# EAGLE schematic DragonBoard (EAGLE 6.6.0)
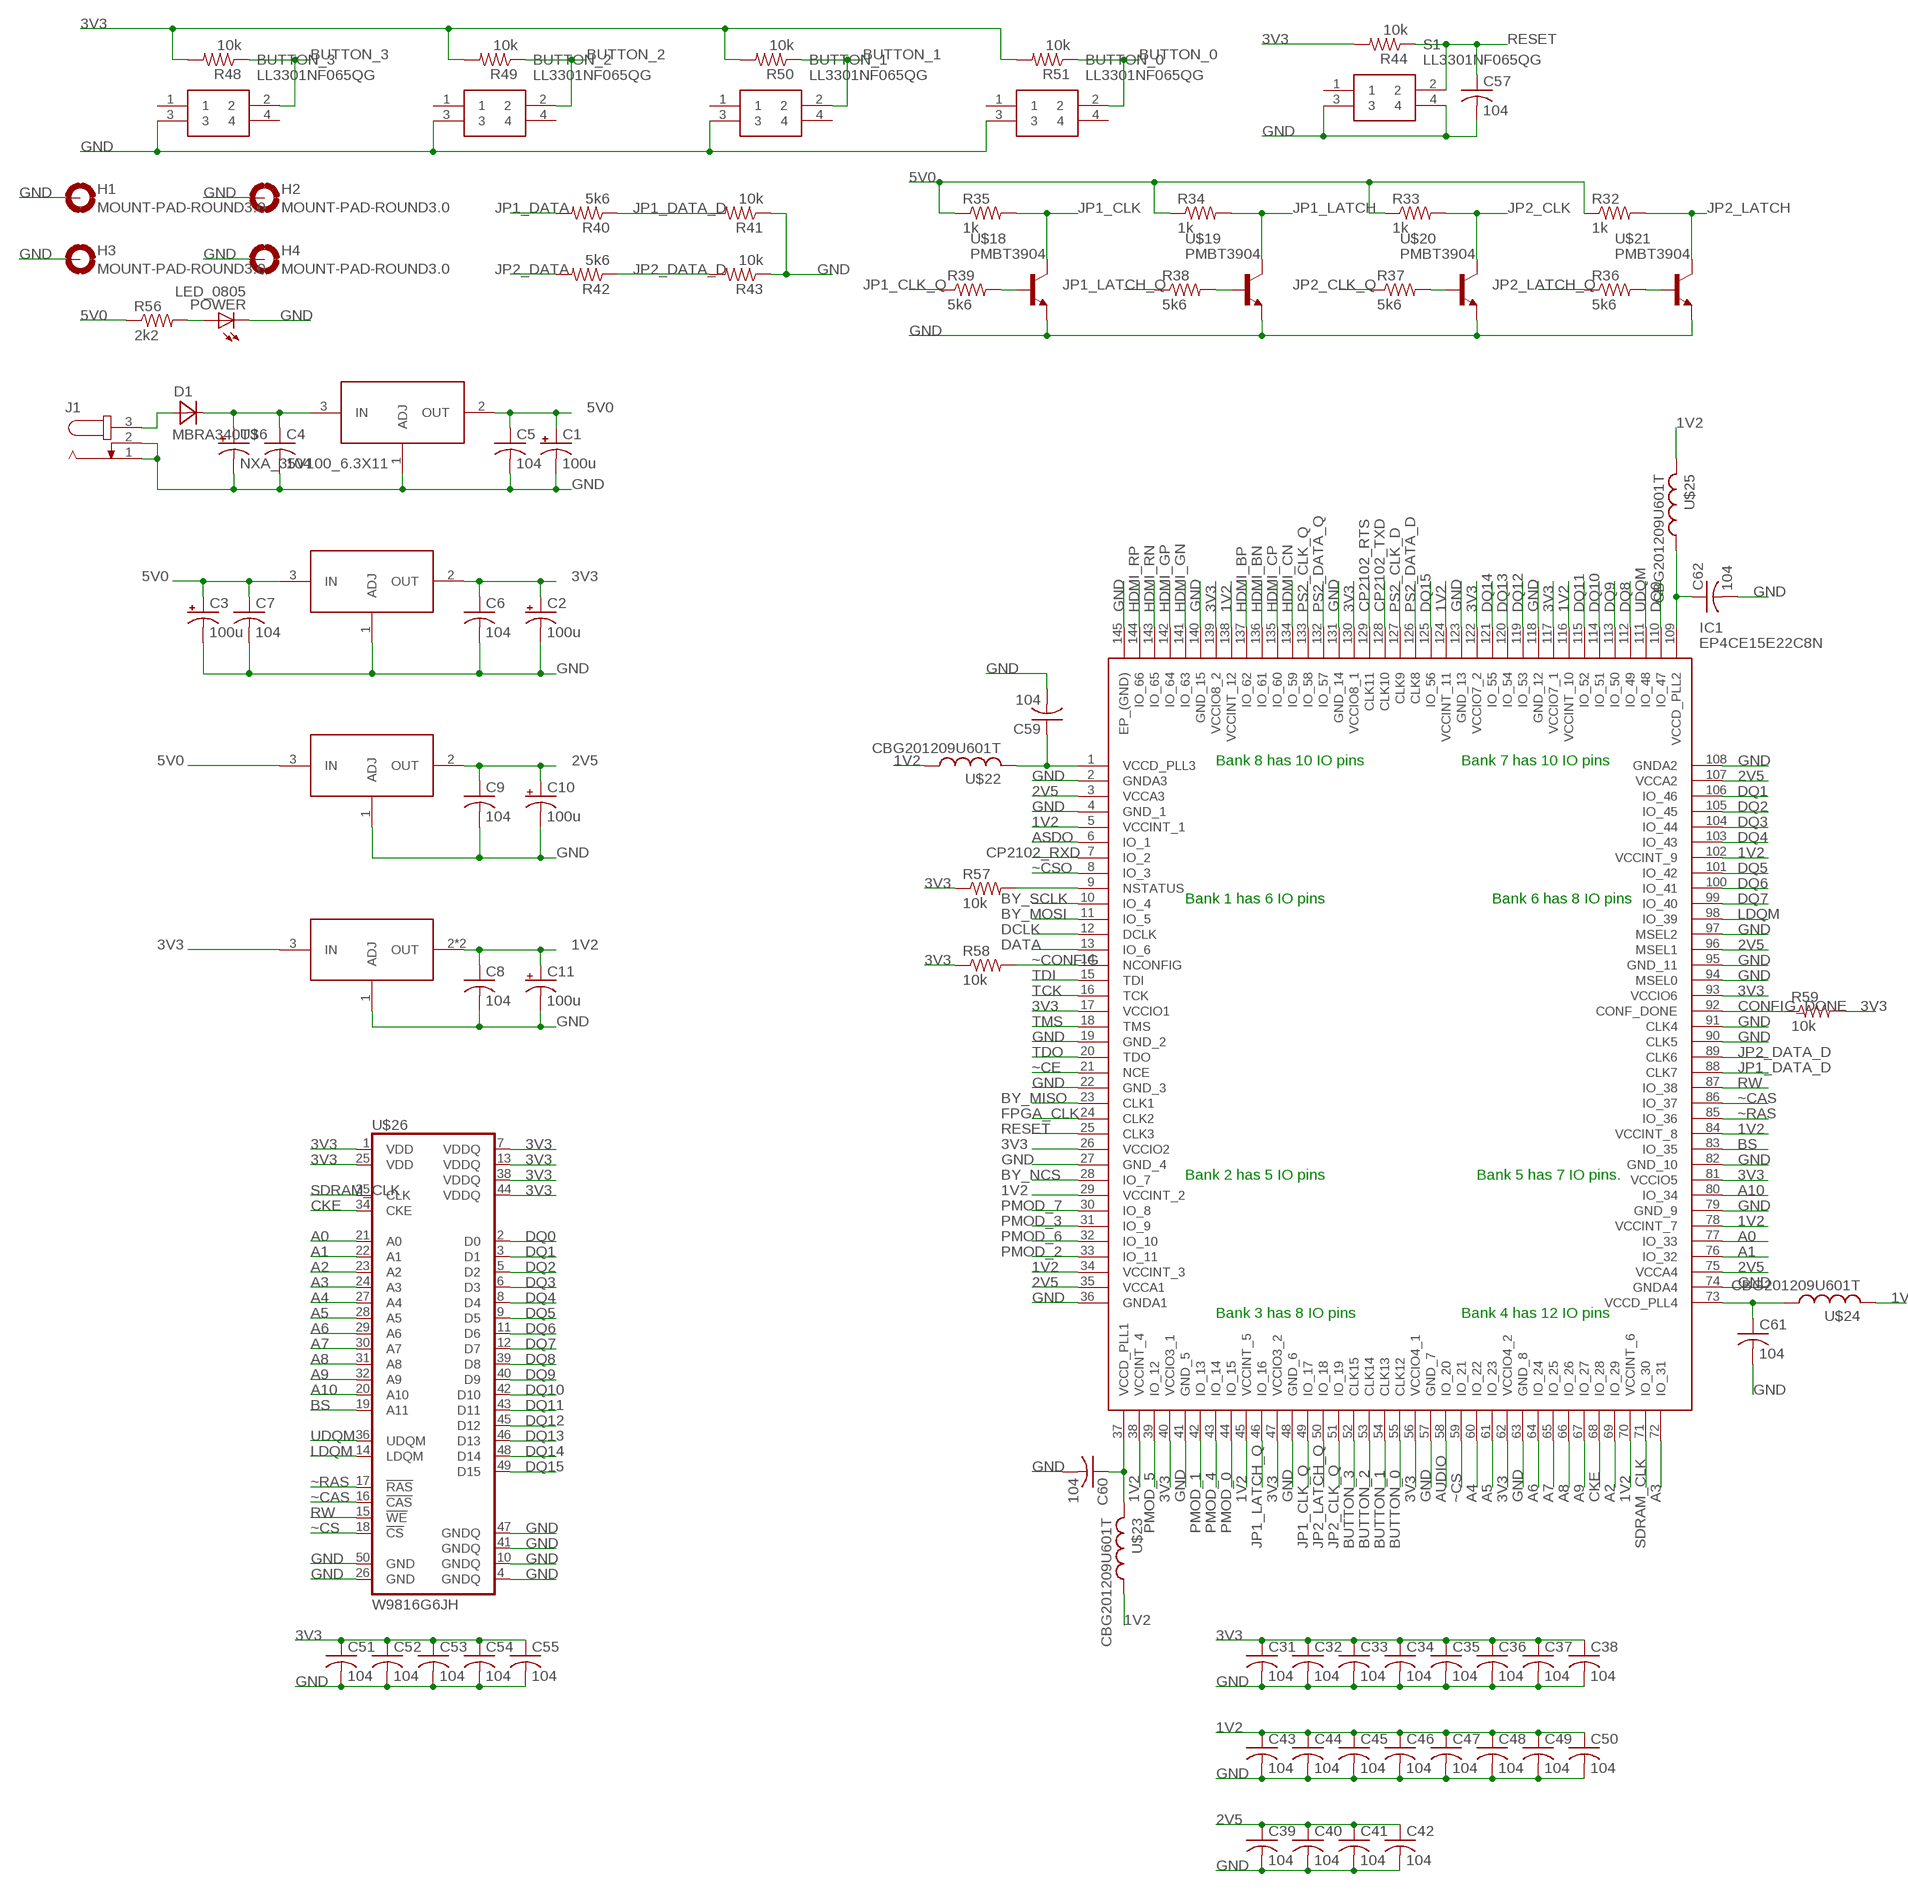
[diagram p0: schematic, sheet 1, part 1 of 2]
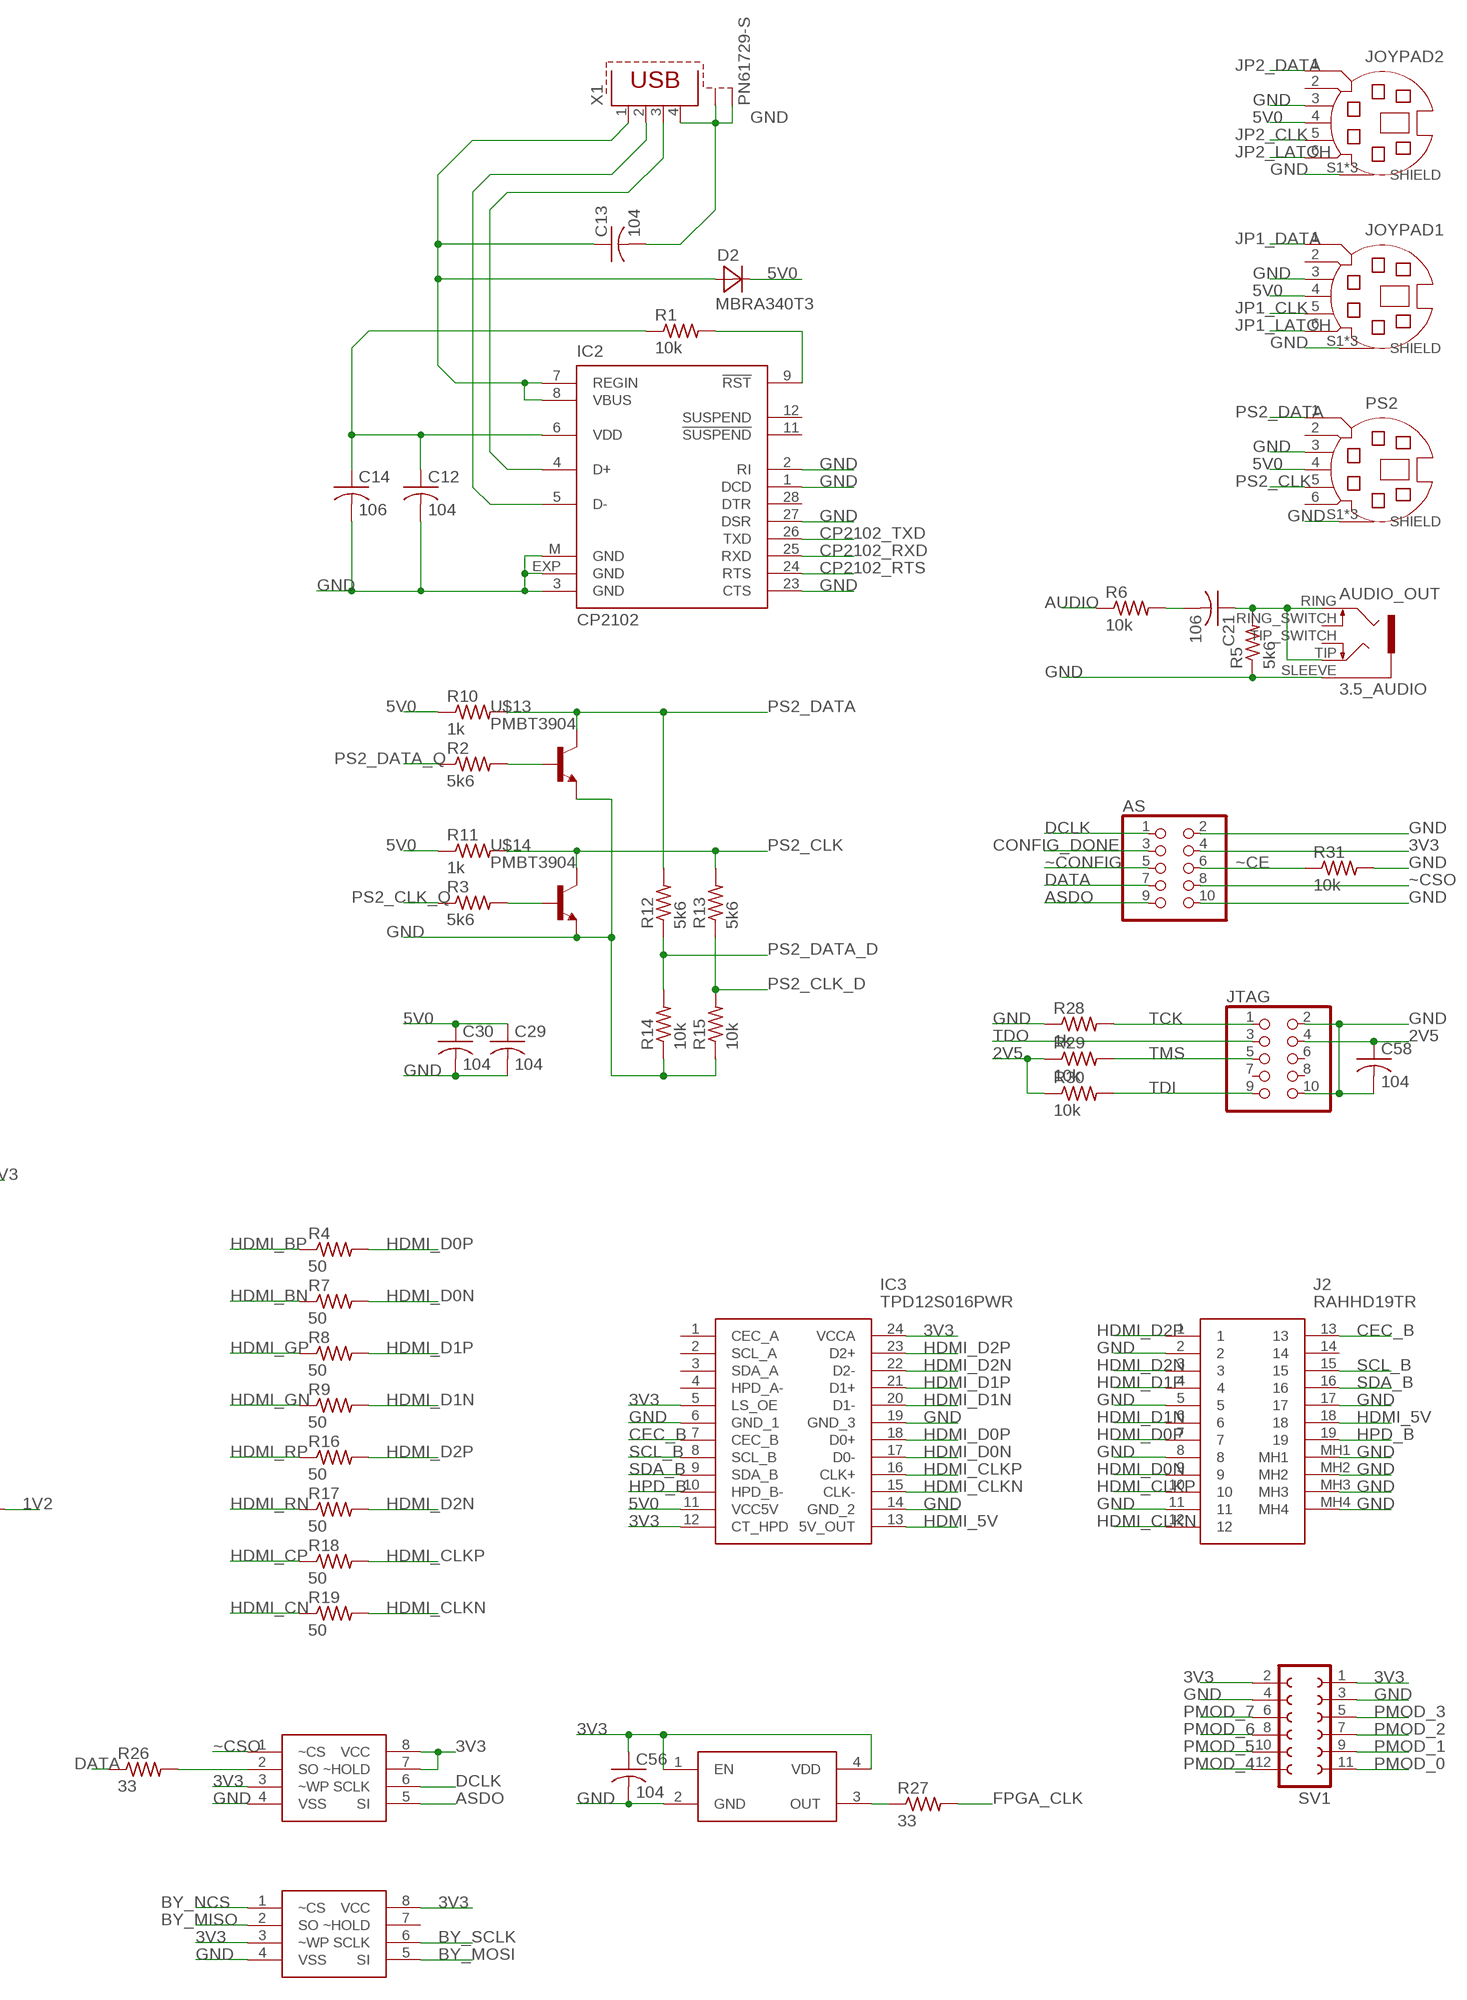
[diagram p1: schematic, sheet 1, part 2 of 2]

## Parts
AS  PINHD-2X5  [2X05]
AUDIO_OUT  3.5_AUDIO  [3.5_AUDIO]
BUTTON_0  LL3301NF065QG  [LL3301NF065QG]
BUTTON_1  LL3301NF065QG  [LL3301NF065QG]
BUTTON_2  LL3301NF065QG  [LL3301NF065QG]
BUTTON_3  LL3301NF065QG  [LL3301NF065QG]
C1  100u  CPOL-USUD-6,3X5,8  [UD-6,3X5,8_NICHICON]
C2  100u  CPOL-USUD-6,3X5,8  [UD-6,3X5,8_NICHICON]
C3  100u  CPOL-USUD-6,3X5,8  [UD-6,3X5,8_NICHICON]
C4  104  C-USC0805  [C0805]
C5  104  C-USC0805  [C0805]
C6  104  C-USC0805  [C0805]
C7  104  C-USC0805  [C0805]
C8  104  C-USC0805  [C0805]
C9  104  C-USC0805  [C0805]
C10  100u  CPOL-USUD-6,3X5,8  [UD-6,3X5,8_NICHICON]
C11  100u  CPOL-USUD-6,3X5,8  [UD-6,3X5,8_NICHICON]
C12  104  C-USC0805  [C0805]
C13  104  C-USC0805  [C0805]
C14  106  C-USC1206  [C1206]
C21  106  C-USC1206  [C1206]
C29  104  C-USC0805  [C0805]
C30  104  C-USC0805  [C0805]
C31  104  C-USC0805  [C0805]
C32  104  C-USC0805  [C0805]
C33  104  C-USC0805  [C0805]
C34  104  C-USC0805  [C0805]
C35  104  C-USC0805  [C0805]
C36  104  C-USC0805  [C0805]
C37  104  C-USC0805  [C0805]
C38  104  C-USC0805  [C0805]
C39  104  C-USC0805  [C0805]
C40  104  C-USC0805  [C0805]
C41  104  C-USC0805  [C0805]
C42  104  C-USC0805  [C0805]
C43  104  C-USC0805  [C0805]
C44  104  C-USC0805  [C0805]
C45  104  C-USC0805  [C0805]
C46  104  C-USC0805  [C0805]
C47  104  C-USC0805  [C0805]
C48  104  C-USC0805  [C0805]
C49  104  C-USC0805  [C0805]
C50  104  C-USC0805  [C0805]
C51  104  C-USC0805  [C0805]
C52  104  C-USC0805  [C0805]
C53  104  C-USC0805  [C0805]
C54  104  C-USC0805  [C0805]
C55  104  C-USC0805  [C0805]
C56  104  C-USC0805  [C0805]
C57  104  C-USC0805  [C0805]
C58  104  C-USC0805  [C0805]
C59  104  C-USC0805  [C0805]
C60  104  C-USC0805  [C0805]
C61  104  C-USC0805  [C0805]
C62  104  C-USC0805  [C0805]
D1  MBRA340T3  [SMA]
D2  MBRA340T3  [SMA]
H1  MOUNT-PAD-ROUND3.0  [3,0-PAD]
H2  MOUNT-PAD-ROUND3.0  [3,0-PAD]
H3  MOUNT-PAD-ROUND3.0  [3,0-PAD]
H4  MOUNT-PAD-ROUND3.0  [3,0-PAD]
IC1  EP4CE15E22C8N  [QFP50P2200X2200X165-145N]
IC2  CP2102  [MLP28]
IC3  TPD12S016PWR  [SOP65P640X120-24N]
J1  JACK-PLUG1  [SPC4078]
J2  RAHHD19TR  [RAHHD19TR]
JOYPAD1  MD06SS  [MDIN06SS]
JOYPAD2  MD06SS  [MDIN06SS]
JTAG  PINHD-2X5  [2X05]
POWER  LED_0805  [CHIP-LED0805]
PS2  MD06SS  [MDIN06SS]
R1  10k  R-US_R0805  [R0805]
R2  5k6  R-US_R0805  [R0805]
R3  5k6  R-US_R0805  [R0805]
R4  50  R-US_R0805  [R0805]
R5  5k6  R-US_R0805  [R0805]
R6  10k  R-US_R0805  [R0805]
R7  50  R-US_R0805  [R0805]
R8  50  R-US_R0805  [R0805]
R9  50  R-US_R0805  [R0805]
R10  1k  R-US_R0805  [R0805]
R11  1k  R-US_R0805  [R0805]
R12  5k6  R-US_R0805  [R0805]
R13  5k6  R-US_R0805  [R0805]
R14  10k  R-US_R0805  [R0805]
R15  10k  R-US_R0805  [R0805]
R16  50  R-US_R0805  [R0805]
R17  50  R-US_R0805  [R0805]
R18  50  R-US_R0805  [R0805]
R19  50  R-US_R0805  [R0805]
R26  33  R-US_R0805  [R0805]
R27  33  R-US_R0805  [R0805]
R28  1k  R-US_R0805  [R0805]
R29  10k  R-US_R0805  [R0805]
R30  10k  R-US_R0805  [R0805]
R31  10k  R-US_R0805  [R0805]
R32  1k  R-US_R0805  [R0805]
R33  1k  R-US_R0805  [R0805]
R34  1k  R-US_R0805  [R0805]
R35  1k  R-US_R0805  [R0805]
R36  5k6  R-US_R0805  [R0805]
R37  5k6  R-US_R0805  [R0805]
R38  5k6  R-US_R0805  [R0805]
R39  5k6  R-US_R0805  [R0805]
R40  5k6  R-US_R0805  [R0805]
R41  10k  R-US_R0805  [R0805]
R42  5k6  R-US_R0805  [R0805]
R43  10k  R-US_R0805  [R0805]
R44  10k  R-US_R0805  [R0805]
R48  10k  R-US_R0805  [R0805]
R49  10k  R-US_R0805  [R0805]
R50  10k  R-US_R0805  [R0805]
R51  10k  R-US_R0805  [R0805]
R56  2k2  R-US_R0805  [R0805]
R57  10k  R-US_R0805  [R0805]
R58  10k  R-US_R0805  [R0805]
R59  10k  R-US_R0805  [R0805]
S1  LL3301NF065QG  [LL3301NF065QG]
SV1  FE06-2W  [FE06-2W]
U$1  BY25Q16BS  [SO08]
U$5  LM1086  [D2PACK]
U$6  NXA_35V100_6.3X11  [NXA_35V100_6.3X11]
U$7  LD1117D-3.3  [TO252]
U$8  KIA1117-2.5  [SOT223]
U$9  AZ1117H-1.2TRG1  [SOT223]
U$12  OT705050MJBA4SL  [ASV32000MHZET]
U$13  PMBT3904  [SOT23]
U$14  PMBT3904  [SOT23]
U$16  BY25Q16BS  [SO08]
U$18  PMBT3904  [SOT23]
U$19  PMBT3904  [SOT23]
U$20  PMBT3904  [SOT23]
U$21  PMBT3904  [SOT23]
U$22  CBG201209U601T  [C0805]
U$23  CBG201209U601T  [C0805]
U$24  CBG201209U601T  [C0805]
U$25  CBG201209U601T  [C0805]
U$26  W9816G6JH  [TSOP50-II]
X1  PN61729-S  [PN61729-S]

## Nets
1V2: C8.1 C11.+ C43.1 C44.1 C45.1 C46.1 C47.1 C48.1 C49.1 C50.1 IC1.5(VCCINT_1) IC1.29(VCCINT_2) IC1.34(VCCINT_3) IC1.38(VCCINT_4) IC1.45(VCCINT_5) IC1.70(VCCINT_6) IC1.78(VCCINT_7) IC1.84(VCCINT_8) IC1.102(VCCINT_9) IC1.116(VCCINT_10) IC1.124(VCCINT_11) IC1.138(VCCINT_12) U$9.2(OUT) U$9.4(OUT) U$22.1 U$23.1 U$24.2 U$25.2
2V5: C9.1 C10.+ C39.1 C40.1 C41.1 C42.1 C58.1 IC1.3(VCCA3) IC1.35(VCCA1) IC1.75(VCCA4) IC1.96(MSEL1) IC1.107(VCCA2) JTAG.4 R29.1 R30.1 U$8.2(OUT)
3V3: AS.4 C2.+ C6.1 C31.1 C32.1 C33.1 C34.1 C35.1 C36.1 C37.1 C38.1 C51.1 C52.1 C53.1 C54.1 C55.1 C56.1 IC1.17(VCCIO1) IC1.26(VCCIO2) IC1.40(VCCIO3_1) IC1.47(VCCIO3_2) IC1.56(VCCIO4_1) IC1.62(VCCIO4_2) IC1.81(VCCIO5) IC1.93(VCCIO6) IC1.117(VCCIO7_1) IC1.122(VCCIO7_2) IC1.130(VCCIO8_1) IC1.139(VCCIO8_2) IC3.5(LS_OE) IC3.12(CT_HPD) IC3.24(VCCA) R44.2 R48.2 R49.2 R50.2 R51.2 R57.1 R58.1 R59.2 SV1.1 SV1.2 U$1.3(~WP) U$1.8(VCC) U$7.2(OUT) U$9.3(IN) U$12.1(EN) U$12.4(VDD) U$16.3(~WP) U$16.7(~HOLD) U$16.8(VCC) U$26.1(VDD) U$26.7(VDDQ) U$26.13(VDDQ) U$26.25(VDD) U$26.38(VDDQ) U$26.44(VDDQ)
5V0: C1.+ C3.+ C5.1 C7.1 C29.1 C30.1 D2.C IC3.11(VCC5V) JOYPAD1.4 JOYPAD2.4 PS2.4 R10.1 R11.1 R32.1 R33.1 R34.1 R35.1 R56.1 U$5.2(OUT) U$7.3(IN) U$8.3(IN)
A0: IC1.77(IO_33) U$26.21(A0)
A1: IC1.76(IO_32) U$26.22(A1)
A2: IC1.69(IO_29) U$26.23(A2)
A3: IC1.72(IO_31) U$26.24(A3)
A4: IC1.60(IO_22) U$26.27(A4)
A5: IC1.61(IO_23) U$26.28(A5)
A6: IC1.64(IO_24) U$26.29(A6)
A7: IC1.65(IO_25) U$26.30(A7)
A8: IC1.66(IO_26) U$26.31(A8)
A9: IC1.67(IO_27) U$26.32(A9)
A10: IC1.80(IO_34) U$26.20(A10)
ASDO: AS.9 IC1.6(IO_1) U$16.5(SI)
AUDIO: IC1.58(IO_20) R6.1
BS: IC1.83(IO_35) U$26.19(A11)
BUTTON_0: BUTTON_0.2 IC1.55(CLK12) R51.1
BUTTON_1: BUTTON_1.2 IC1.54(CLK13) R50.1
BUTTON_2: BUTTON_2.2 IC1.53(CLK14) R49.1
BUTTON_3: BUTTON_3.2 IC1.52(CLK15) R48.1
BY_MISO: IC1.23(CLK1) U$1.2(SO)
BY_MOSI: IC1.11(IO_5) U$1.5(SI)
BY_NCS: IC1.28(IO_7) U$1.1(~CS)
BY_SCLK: IC1.10(IO_4) U$1.6(SCLK)
CEC_B: IC3.7(CEC_B) J2.13
CKE: IC1.68(IO_28) U$26.34(CKE)
CONFIG_DONE: AS.3 IC1.92(CONF_DONE) R59.1
CP2102_RTS: IC1.129(CLK11) IC2.24(RTS)
CP2102_RXD: IC1.7(IO_2) IC2.25(RXD)
CP2102_TXD: IC1.128(CLK10) IC2.26(TXD)
DATA: AS.7 IC1.13(IO_6) R26.1
DCLK: AS.1 IC1.12(DCLK) U$16.6(SCLK)
DQ0: IC1.110(IO_47) U$26.2(D0)
DQ1: IC1.106(IO_46) U$26.3(D1)
DQ2: IC1.105(IO_45) U$26.5(D2)
DQ3: IC1.104(IO_44) U$26.6(D3)
DQ4: IC1.103(IO_43) U$26.8(D4)
DQ5: IC1.101(IO_42) U$26.9(D5)
DQ6: IC1.100(IO_41) U$26.11(D6)
DQ7: IC1.99(IO_40) U$26.12(D7)
DQ8: IC1.112(IO_49) U$26.39(D8)
DQ9: IC1.113(IO_50) U$26.40(D9)
DQ10: IC1.114(IO_51) U$26.42(D10)
DQ11: IC1.115(IO_52) U$26.43(D11)
DQ12: IC1.119(IO_53) U$26.45(D12)
DQ13: IC1.120(IO_54) U$26.46(D13)
DQ14: IC1.121(IO_55) U$26.48(D14)
DQ15: IC1.125(IO_56) U$26.49(D15)
FPGA_CLK: IC1.24(CLK2) R27.2
GND: AS.2 AS.10 AUDIO_OUT.SLEEVE BUTTON_0.3 BUTTON_1.3 BUTTON_2.3 BUTTON_3.3 C1.- C2.- C3.- C4.2 C5.2 C6.2 C7.2 C8.2 C9.2 C10.- C11.- C12.2 C13.2 C14.2 C29.2 C30.2 C31.2 C32.2 C33.2 C34.2 C35.2 C36.2 C37.2 C38.2 C39.2 C40.2 C41.2 C42.2 C43.2 C44.2 C45.2 C46.2 C47.2 C48.2 C49.2 C50.2 C51.2 C52.2 C53.2 C54.2 C55.2 C56.2 C57.2 C58.2 C59.2 C60.2 C61.2 C62.2 H1.B3,0(MOUNT) H2.B3,0(MOUNT) H3.B3,0(MOUNT) H4.B3,0(MOUNT) IC1.2(GNDA3) IC1.4(GND_1) IC1.19(GND_2) IC1.22(GND_3) IC1.27(GND_4) IC1.36(GNDA1) IC1.41(GND_5) IC1.48(GND_6) IC1.57(GND_7) IC1.63(GND_8) IC1.74(GNDA4) IC1.79(GND_9) IC1.82(GND_10) IC1.90(CLK5) IC1.91(CLK4) IC1.94(MSEL0) IC1.95(GND_11) IC1.97(MSEL2) IC1.108(GNDA2) IC1.118(GND_12) IC1.123(GND_13) IC1.131(GND_14) IC1.140(GND_15) IC1.145(EP_(GND)) IC2.1(DCD) IC2.2(RI) IC2.3(GND) IC2.23(CTS) IC2.27(DSR) IC2.EXP(GND) IC2.M(GND) IC3.6(GND_1) IC3.14(GND_2) IC3.19(GND_3) J1.1 J1.2 J2.2 J2.5 J2.8 J2.11 J2.17 J2.MH1 J2.MH2 J2.MH3 J2.MH4 JOYPAD1.3 JOYPAD1.S1(SHIELD) JOYPAD1.S2(SHIELD) JOYPAD1.S3(SHIELD) JOYPAD2.3 JOYPAD2.S1(SHIELD) JOYPAD2.S2(SHIELD) JOYPAD2.S3(SHIELD) JTAG.2 JTAG.10 POWER.C PS2.3 PS2.S1(SHIELD) PS2.S2(SHIELD) PS2.S3(SHIELD) R5.1 R14.1 R15.1 R28.1 R31.2 R41.1 R43.1 S1.3 S1.4 SV1.3 SV1.4 U$1.4(VSS) U$5.1(ADJ) U$6.P$1(-) U$7.1(ADJ) U$8.1(ADJ) U$9.1(ADJ) U$12.2(GND) U$13.2(E) U$14.2(E) U$16.4(VSS) U$18.2(E) U$19.2(E) U$20.2(E) U$21.2(E) U$26.4(GNDQ) U$26.10(GNDQ) U$26.26(GND) U$26.41(GNDQ) U$26.47(GNDQ) U$26.50(GND) X1.4 X1.S1 X1.S2
HDMI_5V: IC3.13(5V_OUT) J2.18
HDMI_BN: IC1.136(IO_61) R7.1
HDMI_BP: IC1.137(IO_62) R4.1
HDMI_CLKN: IC3.15(CLK-) J2.12 R19.2
HDMI_CLKP: IC3.16(CLK+) J2.10 R18.2
HDMI_CN: IC1.134(IO_59) R19.1
HDMI_CP: IC1.135(IO_60) R18.1
HDMI_D0N: IC3.17(D0-) J2.9 R7.2
HDMI_D0P: IC3.18(D0+) J2.7 R4.2
HDMI_D1N: IC3.20(D1-) J2.6 R9.2
HDMI_D1P: IC3.21(D1+) J2.4 R8.2
HDMI_D2N: IC3.22(D2-) J2.3 R17.2
HDMI_D2P: IC3.23(D2+) J2.1 R16.2
HDMI_GN: IC1.141(IO_63) R9.1
HDMI_GP: IC1.142(IO_64) R8.1
HDMI_RN: IC1.143(IO_65) R17.1
HDMI_RP: IC1.144(IO_66) R16.1
HPD_B: IC3.10(HPD_B-) J2.19
JP1_CLK: JOYPAD1.5 R35.2 U$18.3(C)
JP1_CLK_Q: IC1.49(IO_17) R39.1
JP1_DATA: JOYPAD1.1 R40.2
JP1_DATA_D: IC1.88(CLK7) R40.1 R41.2
JP1_LATCH: JOYPAD1.6 R34.2 U$19.3(C)
JP1_LATCH_Q: IC1.46(IO_16) R38.1
JP2_CLK: JOYPAD2.5 R33.2 U$20.3(C)
JP2_CLK_Q: IC1.51(IO_19) R37.1
JP2_DATA: JOYPAD2.1 R42.2
JP2_DATA_D: IC1.89(CLK6) R42.1 R43.2
JP2_LATCH: JOYPAD2.6 R32.2 U$21.3(C)
JP2_LATCH_Q: IC1.50(IO_18) R36.1
LDQM: IC1.98(IO_39) U$26.14(LDQM)
N$4: IC2.9(!RST) R1.2
N$7: C12.1 C14.1 IC2.6(VDD) R1.1
N$8: R2.2 U$13.1(B)
N$9: R3.2 U$14.1(B)
N$14: AUDIO_OUT.RING AUDIO_OUT.TIP C21.1 R5.2
N$17: C21.2 R6.2
N$29: C60.1 IC1.37(VCCD_PLL1) U$23.2
N$31: C59.1 IC1.1(VCCD_PLL3) U$22.2
N$36: C62.1 IC1.109(VCCD_PLL2) U$25.1
N$37: R26.2 U$16.2(SO)
N$38: R27.1 U$12.3(OUT)
N$42: R39.2 U$18.1(B)
N$43: R38.2 U$19.1(B)
N$44: R37.2 U$20.1(B)
N$45: R36.2 U$21.1(B)
N$46: POWER.A R56.2
N$47: C61.1 IC1.73(VCCD_PLL4) U$24.1
N$93: IC1.9(NSTATUS) R57.2
PMOD_0: IC1.44(IO_15) SV1.11
PMOD_1: IC1.42(IO_13) SV1.9
PMOD_2: IC1.33(IO_11) SV1.7
PMOD_3: IC1.31(IO_9) SV1.5
PMOD_4: IC1.43(IO_14) SV1.12
PMOD_5: IC1.39(IO_12) SV1.10
PMOD_6: IC1.32(IO_10) SV1.8
PMOD_7: IC1.30(IO_8) SV1.6
PS2_CLK: PS2.5 R11.2 R13.2 U$14.3(C)
PS2_CLK_D: IC1.127(CLK9) R13.1 R15.2
PS2_CLK_Q: IC1.133(IO_58) R3.1
PS2_DATA: PS2.1 R10.2 R12.2 U$13.3(C)
PS2_DATA_D: IC1.126(CLK8) R12.1 R14.2
PS2_DATA_Q: IC1.132(IO_57) R2.1
RESET: C57.1 IC1.25(CLK3) R44.1 S1.2
RW: IC1.87(IO_38) U$26.15(!WE)
SCL_B: IC3.8(SCL_B) J2.15
SDA_B: IC3.9(SDA_B) J2.16
SDRAM_CLK: IC1.71(IO_30) U$26.35(CLK)
TCK: IC1.16(TCK) JTAG.1 R28.2
TDI: IC1.15(TDI) JTAG.9 R30.2
TDO: IC1.20(TDO) JTAG.3
TMS: IC1.18(TMS) JTAG.5 R29.2
UDQM: IC1.111(IO_48) U$26.36(UDQM)
USB_DN: IC2.5(D-) X1.2
USB_DP: IC2.4(D+) X1.3
VBUS: C13.1 D2.A IC2.7(REGIN) IC2.8(VBUS) X1.1
VHIGH: C4.1 D1.C U$5.3(IN) U$6.P$2(+)
VIN: D1.A J1.3
~CAS: IC1.86(IO_37) U$26.16(!CAS)
~CE: AS.6 IC1.21(NCE) R31.1
~CONFIG: AS.5 IC1.14(NCONFIG) R58.2
~CS: IC1.59(IO_21) U$26.18(!CS)
~CSO: AS.8 IC1.8(IO_3) U$16.1(~CS)
~RAS: IC1.85(IO_36) U$26.17(!RAS)
Unconnected: AUDIO_OUT.RING_SWITCH AUDIO_OUT.TIP_SWITCH BUTTON_0.1 BUTTON_0.4 BUTTON_1.1 BUTTON_1.4 BUTTON_2.1 BUTTON_2.4 BUTTON_3.1 BUTTON_3.4 IC2.11(!SUSPEND) IC2.12(SUSPEND) IC2.28(DTR) IC3.1(CEC_A) IC3.2(SCL_A) IC3.3(SDA_A) IC3.4(HPD_A-) J2.14 JOYPAD1.2 JOYPAD2.2 JTAG.6 JTAG.7 JTAG.8 PS2.2 PS2.6 S1.1 U$1.7(~HOLD)

## Notes on the sheet
- Bank 8 has 10 IO pins | Bank 7 has 10 IO pins
- Bank 1 has 6 IO pins | Bank 6 has 8 IO pins
- Bank 2 has 5 IO pins | Bank 5 has 7 IO pins.
- Bank 3 has 8 IO pins | Bank 4 has 12 IO pins

## Library data of the parts
AS JTAG = Signetics:PINHD-2X5: PIN HEADER
AUDIO_OUT = Signetics:3.5_AUDIO
BUTTON_0 BUTTON_1-BUTTON_3 S1 = Signetics:LL3301NF065QG: E-SWITCH - LL3301NF065QG - TACTILE SW, SPST, 0.05A, 12VDC, SOLDER Source: Datasheet <http://spec_sheets.e-switch.com/specs/P090002.pdf>; DESCRIPTION: E-SWITCH - LL3301NF065QG - TACTILE SW, SPST, 0.05A, 12VDC, SOLDER; HEIGHT: 4mm; MANUFACTURER_NAME: E-Switch; MANUFACTURER_PART_NUMBER: LL3301NF065QG; MOUSER_PART_NUMBER: 612-LL3301NF065QG; MOUSER_PRICE-STOCK: https://www.mouser.co.uk/ProductDetail/E-Switch/LL3301NF065QG?qs=QtyuwXswaQiWhwgY68YTTw%3D%3D
C1-C3 C10 C11 = rcl:CPOL-US: POLARIZED CAPACITOR, American symbol
C4-C9 C12-C14 C21 C29-C62 = rcl:C-US: CAPACITOR, American symbol
D1 D2 = diode:MBRA340T3: Surface Mount Schottky Power Rectifier Source: http://www.onsemi.com/pub_link/Collateral/MBRA340T3-D.PDF
H1-H4 = holes:MOUNT-PAD-ROUND: MOUNTING PAD, round
IC1 = Signetics:EP4CE15E22C8N: Altera FPGA EP4CE15E22C8N, Cyclone IV E 15408 Cells, 504kbit, 963 Blocks, 144-Pin EQFP Source: Datasheet; DESCRIPTION: Altera FPGA EP4CE15E22C8N, Cyclone IV E 15408 Cells, 504kbit, 963 Blocks, 144-Pin EQFP; HEIGHT: 1.65mm; MANUFACTURER_NAME: Intel; MANUFACTURER_PART_NUMBER: EP4CE15E22C8N; MOUSER_PART_NUMBER: 989-EP4CE15E22C8N; MOUSER_PRICE-STOCK: https://www.mouser.co.uk/ProductDetail/Intel-Altera/EP4CE15E22C8N?qs=jblrfmjbeiHyXHcmoANCeA%3D%3D
IC2 = silabs:CP210*: Single-Chip USB to UART Bridge Source: www.silabs.com .. CP2101.pdf / cp2102.pdf; MF: FARNELL; MPN: CP2102-GM; OC_FARNELL: 9282130; OC_NEWARK: 30K5635
IC3 = Signetics:TPD12S016PWR: Texas Instruments,TPD12S016PWR,IC,HDMI TPD12S016PWR, HDMI Interface 12-channel HDMI 4.5 Source: Datasheet <http://www.ti.com/lit/ds/symlink/tpd12s016.pdf>; DESCRIPTION: Texas Instruments,TPD12S016PWR,IC,HDMI TPD12S016PWR, HDMI Interface 12-channel HDMI 4.5; HEIGHT: 1.2mm; MANUFACTURER_NAME: Texas Instruments; MANUFACTURER_PART_NUMBER: TPD12S016PWR; MOUSER_PART_NUMBER: 595-TPD12S016PWR; MOUSER_PRICE-STOCK: https://www.mouser.co.uk/ProductDetail/Texas-Instruments/TPD12S016PWR?qs=Brs2XCuyt3duqIFAdfG0Pg%3D%3D
J1 = con-jack:JACK-PLUG: DC POWER JACK Power Jack, DC, Right Angle, Through Hole, Rated 5A at 16VDC, PC Terminals Distributor: Farnell (www.Farnell.de) Drawing: 84N1161.pdf / 84N1162.pdf Manufacturer: SPC Technology (www.spctechnology.com) Type: SPC4077 / SPC 4078; OC_FARNELL: unknown; OC_NEWARK: unknown
J2 = Signetics:RAHHD19TR: HDMI, Displayport & DVI Connectors HDMI Type A Rcpt Horizontal SMT Source: Datasheet <https://www.switchcraft.com/Drawings/RAHHD19TR_CD.pdf>; DESCRIPTION: HDMI, Displayport & DVI Connectors HDMI Type A Rcpt Horizontal SMT; HEIGHT: 6.68mm; MANUFACTURER_NAME: Switchcraft; MANUFACTURER_PART_NUMBER: RAHHD19TR; MOUSER_PART_NUMBER: 502-RAHHD19TR; MOUSER_PRICE-STOCK: https://www.mouser.co.uk/ProductDetail/Switchcraft/RAHHD19TR?qs=eP2BKZSCXI4eVw73CI8QnQ%3D%3D
JOYPAD1 JOYPAD2 PS2 = con-yamaichi:MD06SS: YAMAICHI CONNECTOR; OC_FARNELL: unknown; OC_NEWARK: unknown
POWER = Signetics:LED_0805
R1-R19 R26-R44 R48-R51 R56-R59 = rcl:R-US_: RESISTOR, American symbol
SV1 = con-lsta:FE06-2W: FEMALE HEADER; OC_FARNELL: unknown; OC_NEWARK: unknown
U$1 U$16 = Signetics:BY25Q16BS
U$5 = Signetics:LM1086
U$6 = Signetics:NXA_35V100_6.3X11
U$7 = Signetics:LD1117D-3.3
U$8 = Signetics:KIA1117-2.5
U$9 = Signetics:AZ1117H-1.2TRG1
U$12 = Signetics:OT705050MJBA4SL
U$13 U$14 U$18-U$21 = Signetics:PMBT3904
U$22-U$25 = Signetics:CBG201209U601T
U$26 = Signetics:W9816G6JH
X1 = con-berg:PN61729-S: BERG USB connector; OC_FARNELL: unknown; OC_NEWARK: unknown